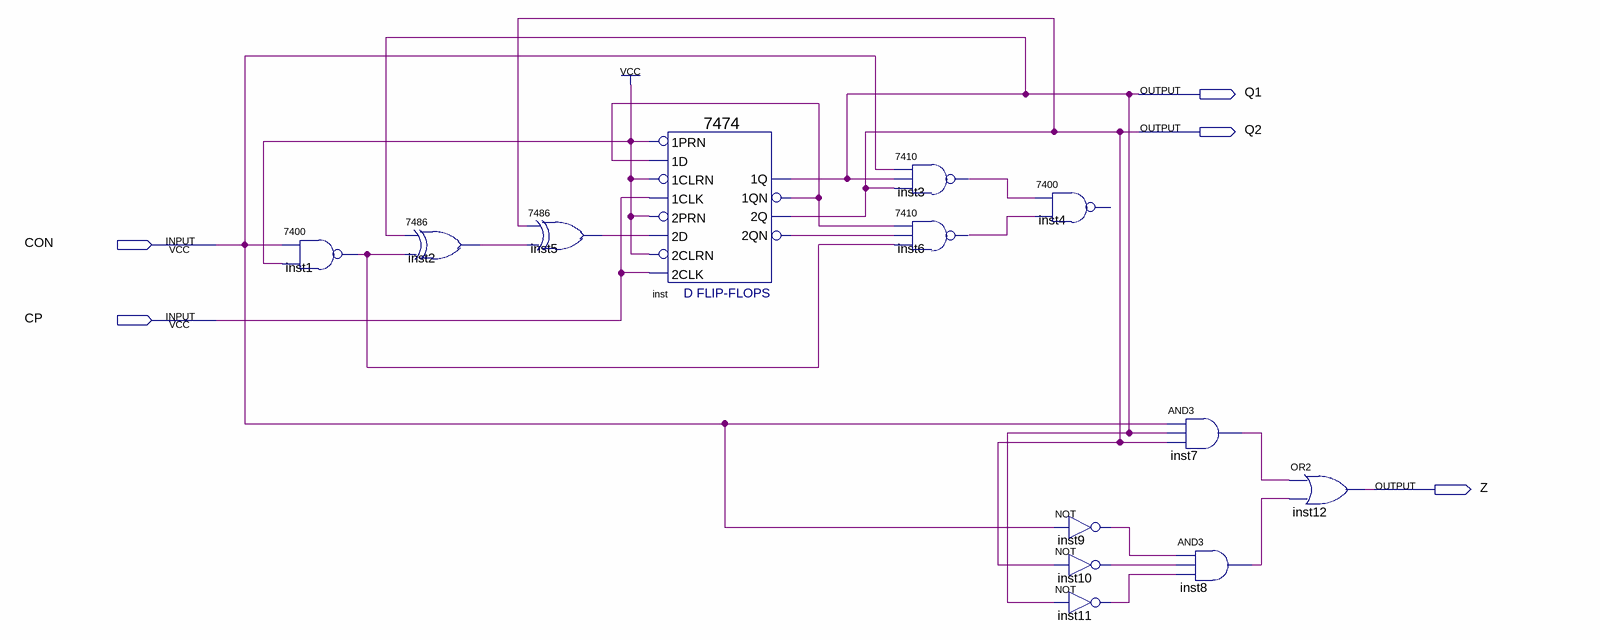
[diagram p0: schematic sheet]
// Quartus schematic CNTR_DIFF.bdf as structural Verilog: 13 symbols, 5 pins
module CNTR_DIFF (
  input  CON,
  input  CP,
  output Q1,
  output Q2,
  output Z
);

  wire inst1_1, inst2_1, inst3_1, inst5_1, inst6_1, inst7_out, inst8_out, inst9_out, inst10_out, inst11_out,
       inst_1qn, inst_2qn;

  \7400  inst1 (.\3 (1'b1), .\2 (CON), .\1 (inst1_1));
  \7486  inst2 (.\2 (Q1), .\3 (inst1_1), .\1 (inst2_1));
  \7486  inst5 (.\2 (Q2), .\3 (inst2_1), .\1 (inst5_1));
  \7474  inst (
    .\2D (inst5_1), .\2PRN (1'b1), .\1CLK (CP), .\1D (inst_1qn), .\1PRN (1'b1), .\2CLK (CP), .\2CLRN (1'b1),
    .\1CLRN (1'b1), .\1QN (inst_1qn), .\2Q (Q2), .\2QN (inst_2qn), .\1Q (Q1));
  \7410  inst3 (.\2 (CON), .\3 (Q1), .\4 (Q2), .\1 (inst3_1));
  \7410  inst6 (.\2 (inst_1qn), .\3 (inst_2qn), .\4 (inst1_1), .\1 (inst6_1));
  \7400  inst4 (.\3 (inst6_1), .\2 (inst3_1));  // open: 1
  not inst9 (inst9_out, CON);
  not inst10 (inst10_out, Q2);
  not inst11 (inst11_out, Q1);
  and inst7 (inst7_out, CON, Q1, Q2);
  and inst8 (inst8_out, inst9_out, inst10_out, inst11_out);
  or inst12 (Z, inst7_out, inst8_out);
endmodule
